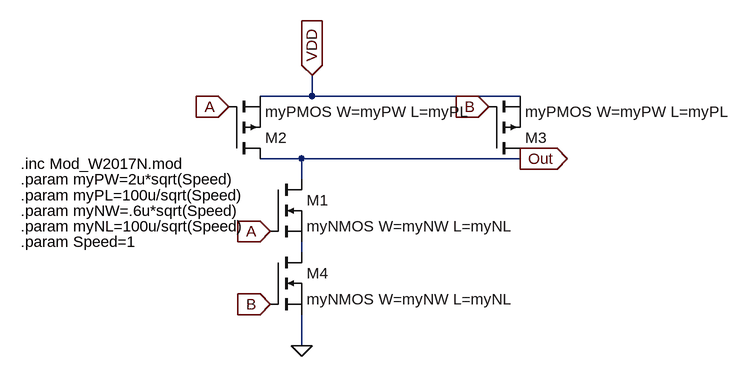
[diagram p0: schematic Gate_NAND_PARAM.asc]
Gate_NAND_PARAM.asc, the LTspice schematic file:
Version 4
SHEET 1 880 680
WIRE 64 -112 64 -144
WIRE 64 -112 -16 -112
WIRE 384 -112 64 -112
WIRE 48 -16 -16 -16
WIRE 384 -16 48 -16
WIRE 48 16 48 -16
WIRE 48 128 48 112
WIRE 48 272 48 224
FLAG 48 272 0
FLAG 64 -144 VDD
IOPIN 64 -144 In
FLAG 0 208 B
IOPIN 0 208 In
FLAG 0 96 A
IOPIN 0 96 In
FLAG -64 -96 A
IOPIN -64 -96 In
FLAG 336 -96 B
IOPIN 336 -96 In
FLAG 384 -16 Out
IOPIN 384 -16 Out
SYMBOL nmos 0 16 R0
SYMATTR InstName M1
SYMATTR Value myNMOS W=myNW L=myNL
SYMBOL pmos -64 -16 M180
SYMATTR InstName M2
SYMATTR Value myPMOS W=myPW L=myPL
SYMBOL pmos 336 -16 M180
SYMATTR InstName M3
SYMATTR Value myPMOS W=myPW L=myPL
SYMBOL nmos 0 128 R0
SYMATTR InstName M4
SYMATTR Value myNMOS W=myNW L=myNL
TEXT -384 -8 Left 2 !.inc Mod_W2017N.mod
TEXT -384 16 Left 2 !.param myPW=2u*sqrt(Speed)
TEXT -384 40 Left 2 !.param myPL=100u/sqrt(Speed)
TEXT -384 64 Left 2 !.param myNW=.6u*sqrt(Speed)
TEXT -384 88 Left 2 !.param myNL=100u/sqrt(Speed)
TEXT -384 112 Left 2 !.param Speed=1

The netlist it stands for:
* Gate_NAND_PARAM.asc
M1 Out A N001 N001 myNMOS W=myNW L=myNL
M2 Out A VDD VDD myPMOS W=myPW L=myPL
M3 Out B VDD VDD myPMOS W=myPW L=myPL
M4 N001 B 0 0 myNMOS W=myNW L=myNL
.model NMOS NMOS
.model PMOS PMOS
.lib standard.mos
.inc Mod_W2017N.mod
.param myPW=2u*sqrt(Speed)
.param myPL=100u/sqrt(Speed)
.param myNW=.6u*sqrt(Speed)
.param myNL=100u/sqrt(Speed)
.param Speed=1
.backanno
.end